# EAGLE design blank (EAGLE 6.3)
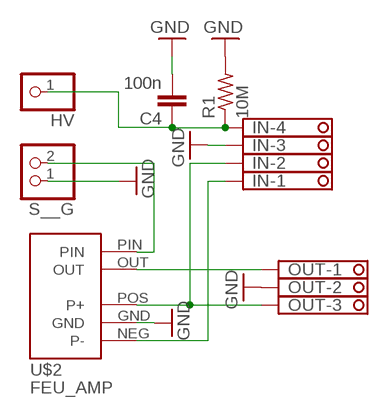
[diagram p0: schematic, sheet 1]

## Parts
C4  100n  C-EU225-087X268  [C225-087X268]
HV  PINHD-1X1  [1X01]
IN  1751264  [1751264]
OUT  1751251  [1751251]
R1  10M  R-US_0207/2V  [0207/2V]
S__G  PINHD-1X2  [1X02]
U$2  FEU_AMP  [FEU_AMP]

## Nets
GND: C4.2 IN.3 OUT.2 R1.2 S__G.1 U$2.GND
N$9: OUT.1 U$2.OUT
N$10: IN.2 OUT.3 U$2.POS(P+)
N$12: C4.1 HV.1 IN.4 R1.1
N$15: S__G.2 U$2.PIN
N$16: IN.1 U$2.NEG(P-)

## Library data of the parts
C4 = resistor:C-EU: CAPACITOR, European symbol
HV = pinhead:PINHD-1X1: PIN HEADER
IN = con-phoenix-350:1751264: MKDS 1/ 4-3,5 Printklemme Nennstrom: 10 A Bemessungsspannung: 160 V Raster: 3,5 mm Polzahl: 4 Montageart: Löten Anschlussart: Schraubanschluss Anschlussrichtung vom Leiter zur Platine: 0° Source: http://eshop.phoenixcontact.com .. 1751264.pdf; MPN: 1751264; OC_FARNELL: unknown; OC_NEWARK: 10R0934
OUT = con-phoenix-350:1751251: MKDS 1/ 3-3,5 Printklemme Nennstrom: 10 A Bemessungsspannung: 160 V Raster: 3,5 mm Polzahl: 3 Montageart: Löten Anschlussart: Schraubanschluss Anschlussrichtung vom Leiter zur Platine: 0° Source: http://eshop.phoenixcontact.com .. 1751251.pdf; OC_FARNELL: unknown; OC_NEWARK: unknown
R1 = resistor:R-US_: RESISTOR, American symbol
S__G = pinhead:PINHD-1X2: PIN HEADER
U$2 = pwr:FEU_AMP: FEU amplifier

## Board
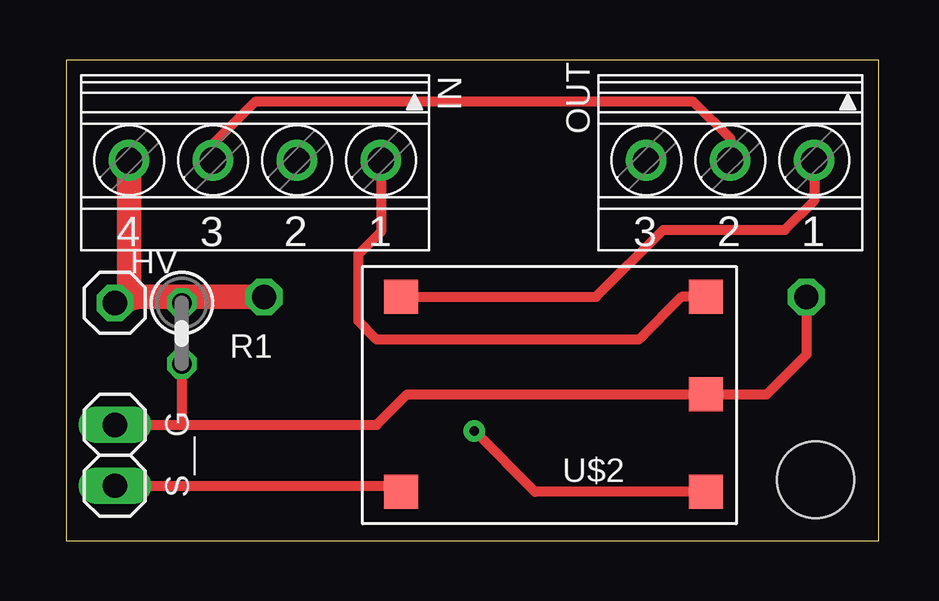
[diagram p1: board, top side]
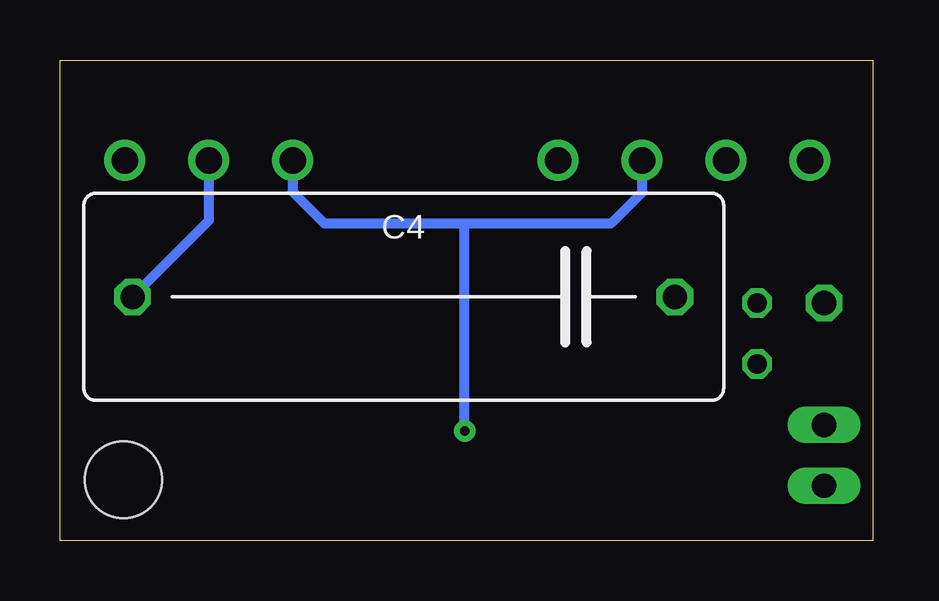
[diagram p2: board, bottom side, seen from below]

Size 33.89 x 20.03 mm. Coordinates in mm from the lower left corner, seen from the top.
Outline: 0,0 33.89,0 33.89,20.03 0,20.03 0,0
Copper layers (1*16): Top 0.035mm / dielectric 1.5mm / Bottom 0.035mm
Design rules "PCBCart-proto": minimum track width 5mil, minimum drill 0.2mm, track to track 6mil, track to pad 6mil, pad to pad 6mil, via to via 6mil, smd to smd 5mil, copper to edge 20mil, drill to drill 8mil, minimum pad ring 8mil, minimum via ring 10mil, stop-mask expansion 3mil, vias tented up to drill 0mil, thermal gap 8mil
Holes 3.2 mm at 31.24,2.54

### Footprints (pad centres in the part's own frame; a part is rotated, then mirrored left to right if it is on the bottom)
C225-087X268 = drill 1.016 octagon: 1 -11.303,0; 2 11.303,0
1X01 = drill 1.016 octagon: 1 0,0
1751264 = drill 1.1 pad 1.7: 1 -5.25,-0.1; 2 -1.75,-0.1; 3 1.75,-0.1; 4 5.25,-0.1
1751251 = drill 1.1 pad 1.7: 1 -3.5,-0.1; 2 0,-0.1; 3 3.5,-0.1
0207/2V = drill 0.813 octagon: 1 -1.27,0; 2 1.27,0
1X02 = drill 1.016 long: 1 -1.27,0; 2 1.27,0
FEU_AMP = smd 1.422 x 1.422: GND -6.35,0.254; NEG -6.35,-3.81; OUT 6.35,-3.81; PIN 6.35,4.318; POS -6.35,4.318

### Placement (x,y rotation side)
C4  19.56,10.16 180 bottom
HV  2.03,9.91 0 top
IN  7.87,15.75 180 top
OUT  27.69,15.75 180 top
R1  4.83,8.64 270 top
S__G  2.03,3.56 270 top
U$2  20.32,6.35 180 top

### Tracks (layer width: path | path; a pad name or v marks a point on that pad's centre or on a via)
GND
  Top 0.406: C4.2 30.86,7.75 29.21,6.1 U$2.GND 14.22,6.1 12.95,4.83 4.83,4.83 | OUT.2 27.69,16.76 26.16,18.29 7.87,18.29 6.12,16.54 IN.3 | S__G.1 4.83,4.83 | R1.2 4.83,4.83
  Bottom 0.406: OUT.2 27.69,13.34 C4.2
N$9
  Top 0.406: U$2.OUT 22.1,10.16 24.89,12.95 29.97,12.95 31.19,14.17 OUT.1
N$10  (via drill 0.4)
  Top 0.406: U$2.POS 19.56,2.03 v17.02,4.57
  Bottom 0.406: OUT.3 24.19,14.53 22.86,13.21 17.02,13.21 | IN.2 9.62,14.51 10.92,13.21 17.02,13.21 | v17.02,4.57 17.02,13.21
N$12
  Top 0.406: R1.1 4.83,10.16
  Top 1.016: IN.4 2.62,10.16 3.05,10.16 | C4.1 4.83,10.16 3.05,10.16 | HV.1 3.05,10.16
N$15
  Top 0.406: S__G.2 13.72,2.29 U$2.PIN
N$16
  Top 0.406: U$2.NEG 25.65,10.16 23.88,8.38 12.95,8.38 12.19,9.14 12.19,11.94 13.12,12.87 IN.1